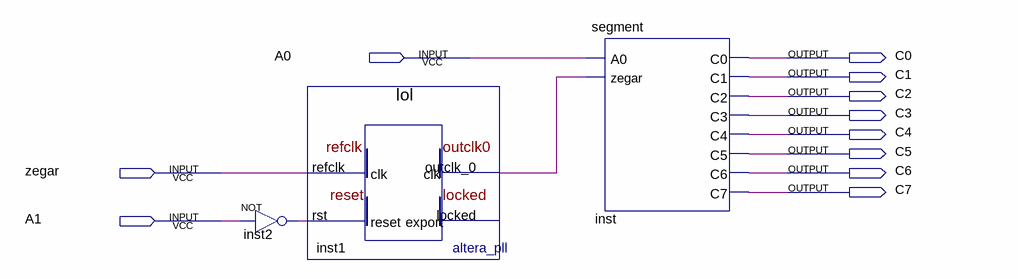
[diagram p0: schematic sheet]
// Quartus schematic Block1.bdf as structural Verilog: 3 symbols, 11 pins
module Block1 (
  input  A0,
  input  zegar,
  input  A1,
  output C0,
  output C1,
  output C2,
  output C3,
  output C4,
  output C5,
  output C6,
  output C7
);

  wire inst1_outclk_0, inst2_out;

  not inst2 (inst2_out, A1);
  lol inst1 (.refclk(zegar), .rst(inst2_out), .outclk_0(inst1_outclk_0));  // open: locked
  segment inst (
    .A0(A0), .zegar(inst1_outclk_0), .C0(C0), .C1(C1), .C2(C2), .C3(C3), .C4(C4), .C5(C5), .C6(C6), .C7(C7));
endmodule
